# Altium schematic sheet zasilanie.SchDoc: Smartwatch
size 292 x 193 mm; Author: Weronika Majcher; CompanyName: Politechnika Warszawska; Organization: EITI; Revision: 1; SheetNumber: 2; SheetTotal: 4; ProjName: Zasilanie; Group_Name: Smartwatch
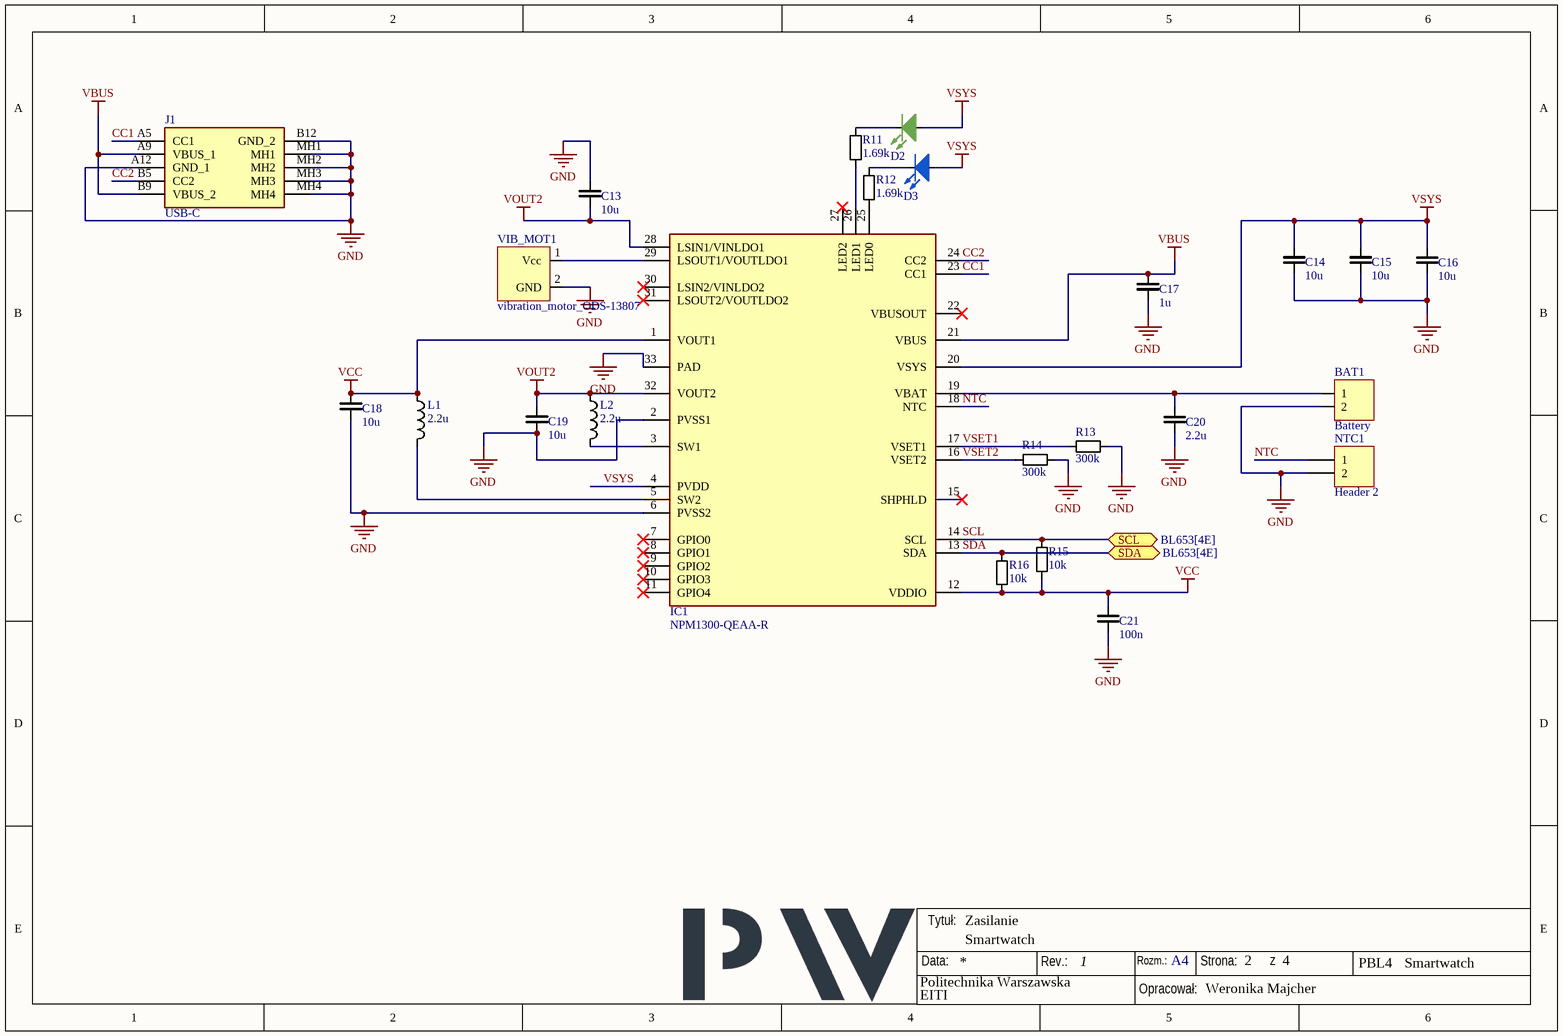
[diagram p0: zasilanie.SchDoc]

## Parts
BAT1  Battery  [RHDR20W60P0X254_1X20_5130X250X888P]
C13  10u  [0402_CAP_REFLOW]
C14  10u  [0402_CAP_REFLOW]
C15  10u  [0402_CAP_REFLOW]
C16  10u  [0402_CAP_REFLOW]
C17  1u  [0402_CAP_REFLOW]
C18  10u  [0402_CAP_REFLOW]
C19  10u  [0402_CAP_REFLOW]
C20  2.2u  [0402_CAP_REFLOW]
C21  100n  [0402_CAP_REFLOW]
D2  (no value)  [LED_G]
D3  (no value)  [LED_G]
IC1  NPM1300-QEAA-R  [nPM1300-QFN50P500X500X90-33N]
J1  USB-C  [USB-C]
L1  2.2u  [0603_IND_2.2u_30%_DCR<400m?]
L2  2.2u  [0603_IND_2.2u_30%_DCR<400m?]
NTC1  Header 2  [RHDR20W60P0X254_1X20_5130X250X888P]
R11  1.69k  [0402_RES_REFLOW]
R12  1.69k  [0402_RES_REFLOW]
R13  300k  [0402_RES_REFLOW]
R14  300k  [0402_RES_REFLOW]
R15  10k  [0402_RES_REFLOW]
R16  10k  [0402_RES_REFLOW]
VIB_MOT1  vibration_motor_ODS-13807  [RHDR20W60P0X254_1X20_5130X250X888P]

## Ports
SCL (bidir, see BL653[4E]), SDA (bidir, see BL653[4E])

## Nets
GND: BAT1.2 C13.2 C14.1 C15.1 C16.1 C17.1 C18.1 C19.1 C20.1 C21.1 IC1.2(PVSS1) IC1.6(PVSS2) IC1.33(PAD) J1.A12(GND_1) J1.B12(GND_2) J1.MH1 J1.MH2 J1.MH3 J1.MH4 NTC1.2 R13.2 R14.2 VIB_MOT1.2(GND)
VBUS: C17.2 IC1.21(VBUS) J1.A9(VBUS_1) J1.B9(VBUS_2)
VCC: C18.2 C21.2 IC1.1(VOUT1) IC1.12(VDDIO) L1.2 R15.1 R16.1
VOUT2: C13.1 C19.2 IC1.28(LSIN1/VINLDO1) IC1.32(VOUT2) L2.2
VSYS: C14.2 C15.2 C16.2 D2.1(A) D3.1(A) IC1.4(PVDD) IC1.20(VSYS)
CC1: IC1.23(CC1) J1.A5(CC1)
CC2: IC1.24(CC2) J1.B5(CC2)
NTC: IC1.18(NTC) NTC1.1
SCL: IC1.14(SCL) R15.2 ; port SCL
SDA: IC1.13(SDA) R16.2 ; port SDA
VSET1: IC1.17(VSET1) R13.1
VSET2: IC1.16(VSET2) R14.1
NetBAT1_1: BAT1.1 C20.2 IC1.19(VBAT)
NetD2_2: D2.2(K) R11.2
NetD3_2: D3.2(K) R12.2
NetIC1_3: IC1.3(SW1) L2.1
NetIC1_5: IC1.5(SW2) L1.1
NetIC1_25: IC1.25(LED0) R12.1
NetIC1_26: IC1.26(LED1) R11.1
NetIC1_29: IC1.29(LSOUT1/VOUTLDO1) VIB_MOT1.1(Vcc)

Not connected (* = marked no-connect by the designer): IC1 7(GPIO0)* 8(GPIO1)* 9(GPIO2)* 10(GPIO3)* 11(GPIO4)* 15(SHPHLD)* 22(VBUSOUT)* 27(LED2)* 30(LSIN2/VINLDO2)* 31(LSOUT2/VOUTLDO2)*

## Notes on the sheet
- Data:
- Tytuł:
- Rev.:
- Rozm.:
- A4
- Strona:
- z
- PBL4
- Opracował:

## Library data of the parts
BAT1 = Battery: BATTERY, Li-ion, Li-polymer, or LiFePO4; LatestRevisionDate: 17-Jul-2002; LatestRevisionNote: Re-released for DXP Platform.; Publisher: Altium Limited
C13-C16 C18 C19 = Cap_0402_10u: Ceramic capacitor
C17 = Cap_0402_1u: Ceramic capacitor
C20 = Cap_0402_2.2u: Ceramic capacitor
C21 = Cap_0402_100n: Ceramic capacitor
D2 = LED_G
D3 = LED_B
IC1 = NPM1300-QEAA-R: Integrated Circuit; Manufacturer_Name: Nordic Semiconductor; Datasheet Link: https://infocenter.nordicsemi.com/index.jsp?topic=%2Fstruct_pmic%2Fstruct%2Fnpm1300.html; Height: 0.9mm; Manufacturer_Part_Number: NPM1300-QEAA-R; Mouser Part Number: 949-NPM1300-QEAA-R; Mouser Price/Stock: https://www.mouser.co.uk/ProductDetail/Nordic-Semiconductor/nPM1300-QEAA-R?qs=3pZoU%2F6IRTiFavqFmjPoaw%3D%3D
J1 = USB-C: Connector; Manufacturer_Name: Molex; Manufacturer_Part_Number: 217175-0001; Datasheet Link: https://www.molex.com/pdm_docs/sd/2171750001_sd.pdf; Height: 3.46mm; Mouser Part Number: 538-217175-0001; Mouser Price/Stock: https://www.mouser.co.uk/ProductDetail/Molex/217175-0001?qs=DRkmTr78QARWJMiqNnldSg%3D%3D
L1 L2 = L_0603_2.2u_30%_DCR<400mΩ: Inductor
NTC1 = NTC_1%: NTC, 10 / 47 / 100 k; LatestRevisionDate: 17-Jul-2002; LatestRevisionNote: Re-released for DXP Platform.; Publisher: Altium Limited
R11 = RES_0402_1.69k_1: Resistor, green LED
R12 = RES_0402_1.69k: Resistor, blue LED
R13 R14 = RES_0402_300k_0.05W_1%: Resistor
R15 R16 = Resistor R10K